# Altium schematic sheet BackUp_uC.SchDoc: uC
size A3; DrawnBy: MAC; Revision: 0; Project: FotoKite; DrwanWhen: Nov.2013; CheckedWhen: When?
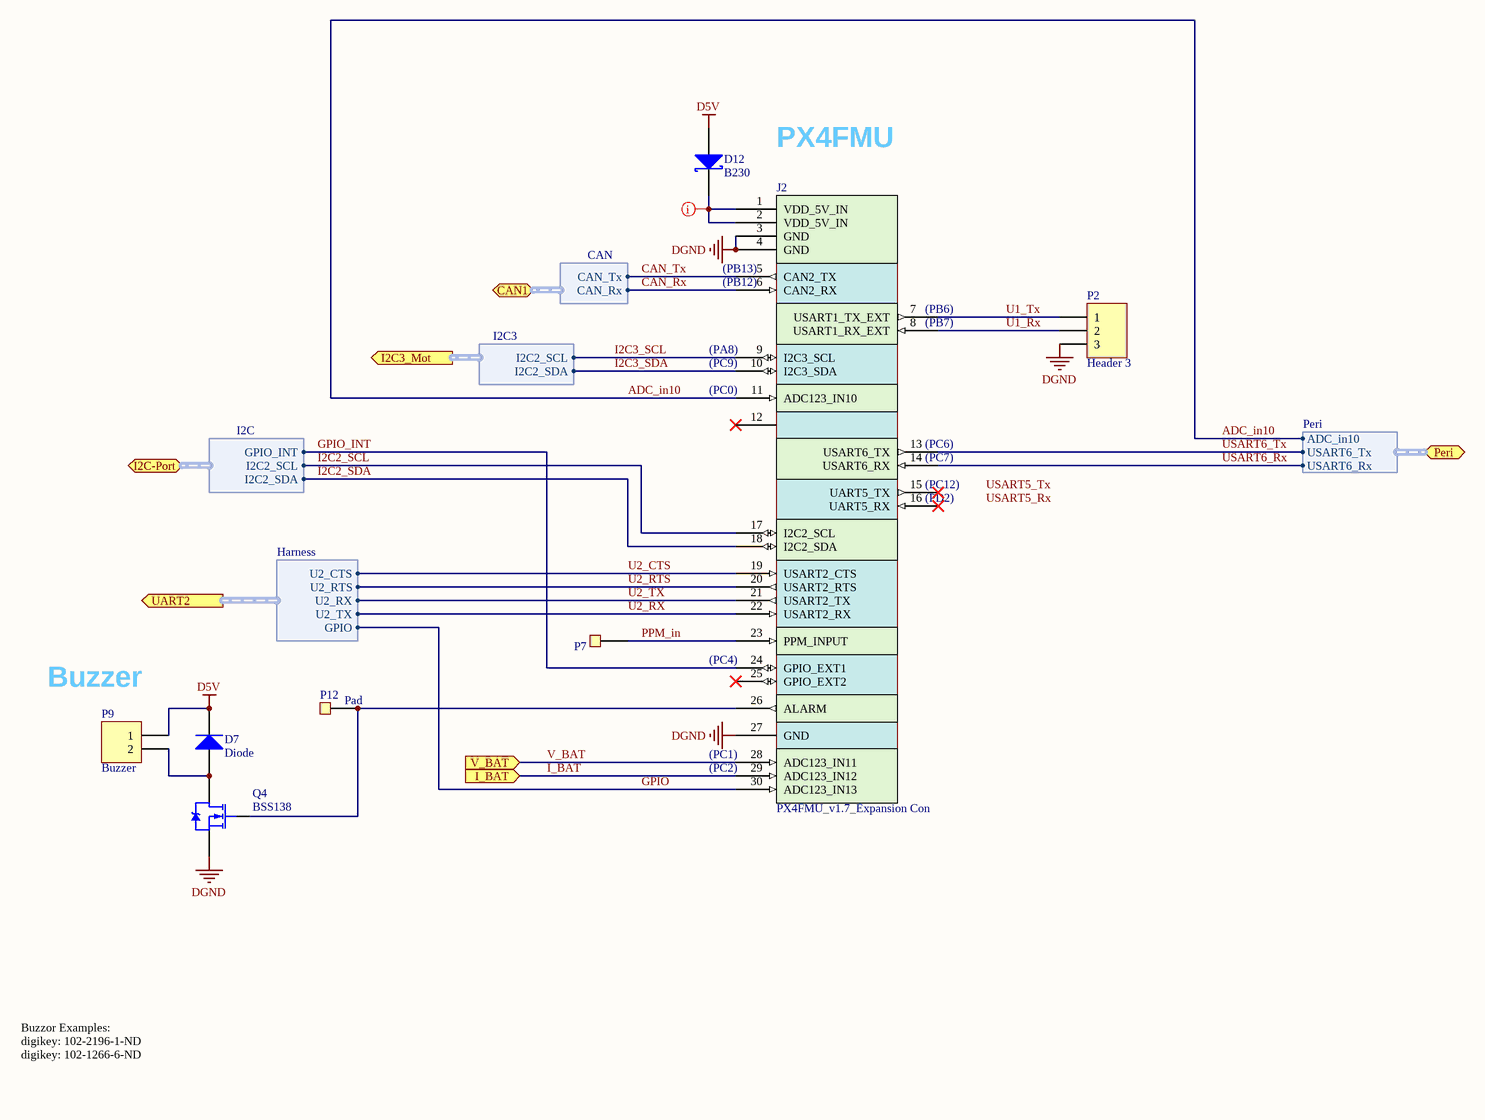
[diagram p0: BackUp_uC.SchDoc]

## Parts
D7  Diode  [Mini MELF - SOD-80 -N]
D12  B230  [Diode SMB DO-214aa -N]
J2  PX4FMU_v1.7_Expansion Con  [PX4FMU_v1.7_module_sicket]
P2  Header 3  [HDR1X3]
P7  Pad  [PIN1 style 2]  (value not drawn)
P9  Buzzer  [HDR1X2]
P12  Pad  [Pad_0603]
Q4  BSS138  [SOT23-N]

## Ports
CAN1 (harness CAN), I2C3_Mot (harness I2C3), I2C-Port (harness I2C), I_BAT (in), Peri (harness Peri), UART2 (harness Harness), V_BAT (in)

## Harnesses
I2C3: I2C2_SCL, I2C2_SDA
Harness: U2_RTS, U2_CTS, U2_RX, U2_TX, GPIO
CAN: CAN_Tx, CAN_Rx
I2C: GPIO_INT, I2C2_SCL, I2C2_SDA
Peri: ADC_in10, USART6_Tx, USART6_Rx

## Nets
D5V: D7.2(K) D12.1(A) P9.1
DGND: J2.3(GND) J2.4(GND) J2.27(GND) P2.3 Q4.2(S)
ADC_in10: J2.11(ADC123_IN10) ; port Peri.ADC_in10
CAN_Rx: J2.6(CAN2_RX) ; port CAN1.CAN_Rx
CAN_Tx: J2.5(CAN2_TX) ; port CAN1.CAN_Tx
GPIO: J2.30(ADC123_IN13) ; port UART2.GPIO
GPIO_INT: J2.24(GPIO_EXT1) ; port I2C-Port.GPIO_INT
I2C2_SCL: J2.17(I2C2_SCL) ; port I2C-Port.I2C2_SCL
I2C2_SDA: J2.18(I2C2_SDA) ; port I2C-Port.I2C2_SDA
I2C3_SCL: J2.9(I2C3_SCL) ; port I2C3_Mot.I2C2_SCL
I2C3_SDA: J2.10(I2C3_SDA) ; port I2C3_Mot.I2C2_SDA
I_BAT: J2.29(ADC123_IN12) ; port I_BAT
PPM_in: J2.23(PPM_INPUT) P7.1
U1_Rx: J2.8(USART1_RX_EXT) P2.2
U1_Tx: J2.7(USART1_TX_EXT) P2.1
U2_CTS: J2.19(USART2_CTS) ; port UART2.U2_CTS
U2_RTS: J2.20(USART2_RTS) ; port UART2.U2_RTS
U2_RX: J2.22(USART2_RX) ; port UART2.U2_TX
U2_TX: J2.21(USART2_TX) ; port UART2.U2_RX
USART6_Rx: J2.14(USART6_RX) ; port Peri.USART6_Rx
USART6_Tx: J2.13(USART6_TX) ; port Peri.USART6_Tx
V_BAT: J2.28(ADC123_IN11) ; port V_BAT
NetD7_1: D7.1(A) P9.2 Q4.3(D)
NetD12_2: D12.2(K) J2.1(VDD_5V_IN) J2.2(VDD_5V_IN)
NetJ2_26: J2.26(ALARM) P12.1 Q4.1(G)

Not connected (* = marked no-connect by the designer): J2 12* 15(UART5_TX)* 16(UART5_RX)* 25(GPIO_EXT2)*

## Layout directives
net class Power: NetD12_2

## Notes on the sheet
- PX4FMU
- (near J2) (PB13)
- (near J2) (PB12)
- (near J2) (PA8)
- (near J2) (PB6)
- (near J2) (PB7)
- (near J2) (PC0)
- (near J2) (PC9)
- (near J2) (PC6)
- (near J2) (PC7)
- (near J2) (PC12)
- (near J2) (PD2)
- (near P9) Buzzer
- (near J2) (PC4)
- (near J2) (PC1)
- (near J2) (PC2)
- Buzzor Examples:
  digikey: 102-2196-1-ND
  digikey: 102-1266-6-ND
- Labels drawn without touching a wire or pin: USART5_Rx, USART5_Tx
- Sheet
- Project:
- Title:
- of
- Rev:
- Printed:
- Drawn:
- @
- Checked:
- Drawing Size:
- A3
- File:

## Library data of the parts
D7 = Diode: Default Diode
D12 = Diode  Schottky: Schottky Diode; Manufacturer ID: Diodes Inc: B230-13-F; Note: Alternative: SS24/1; Supplier: digi-key: B230-FDICT-ND
J2 = PX4FMU_v1.7_Expansion Con_1: J2 / J3; Supplier: digikey: 3M9197CT-ND
P2 = Header 3: Header, 3-Pin
P7 P12 = Pad: Single Pad or Testpoint
P9 = Header 2: Header, 2-Pin
Q4 = MOSFET-N2: N-Channel MOSFET; Note: Check footprint as it may  differ; Supplier: digikey: BSS138-FDICT-ND; price (1) €: 0.29; price (100) €: 0.1469